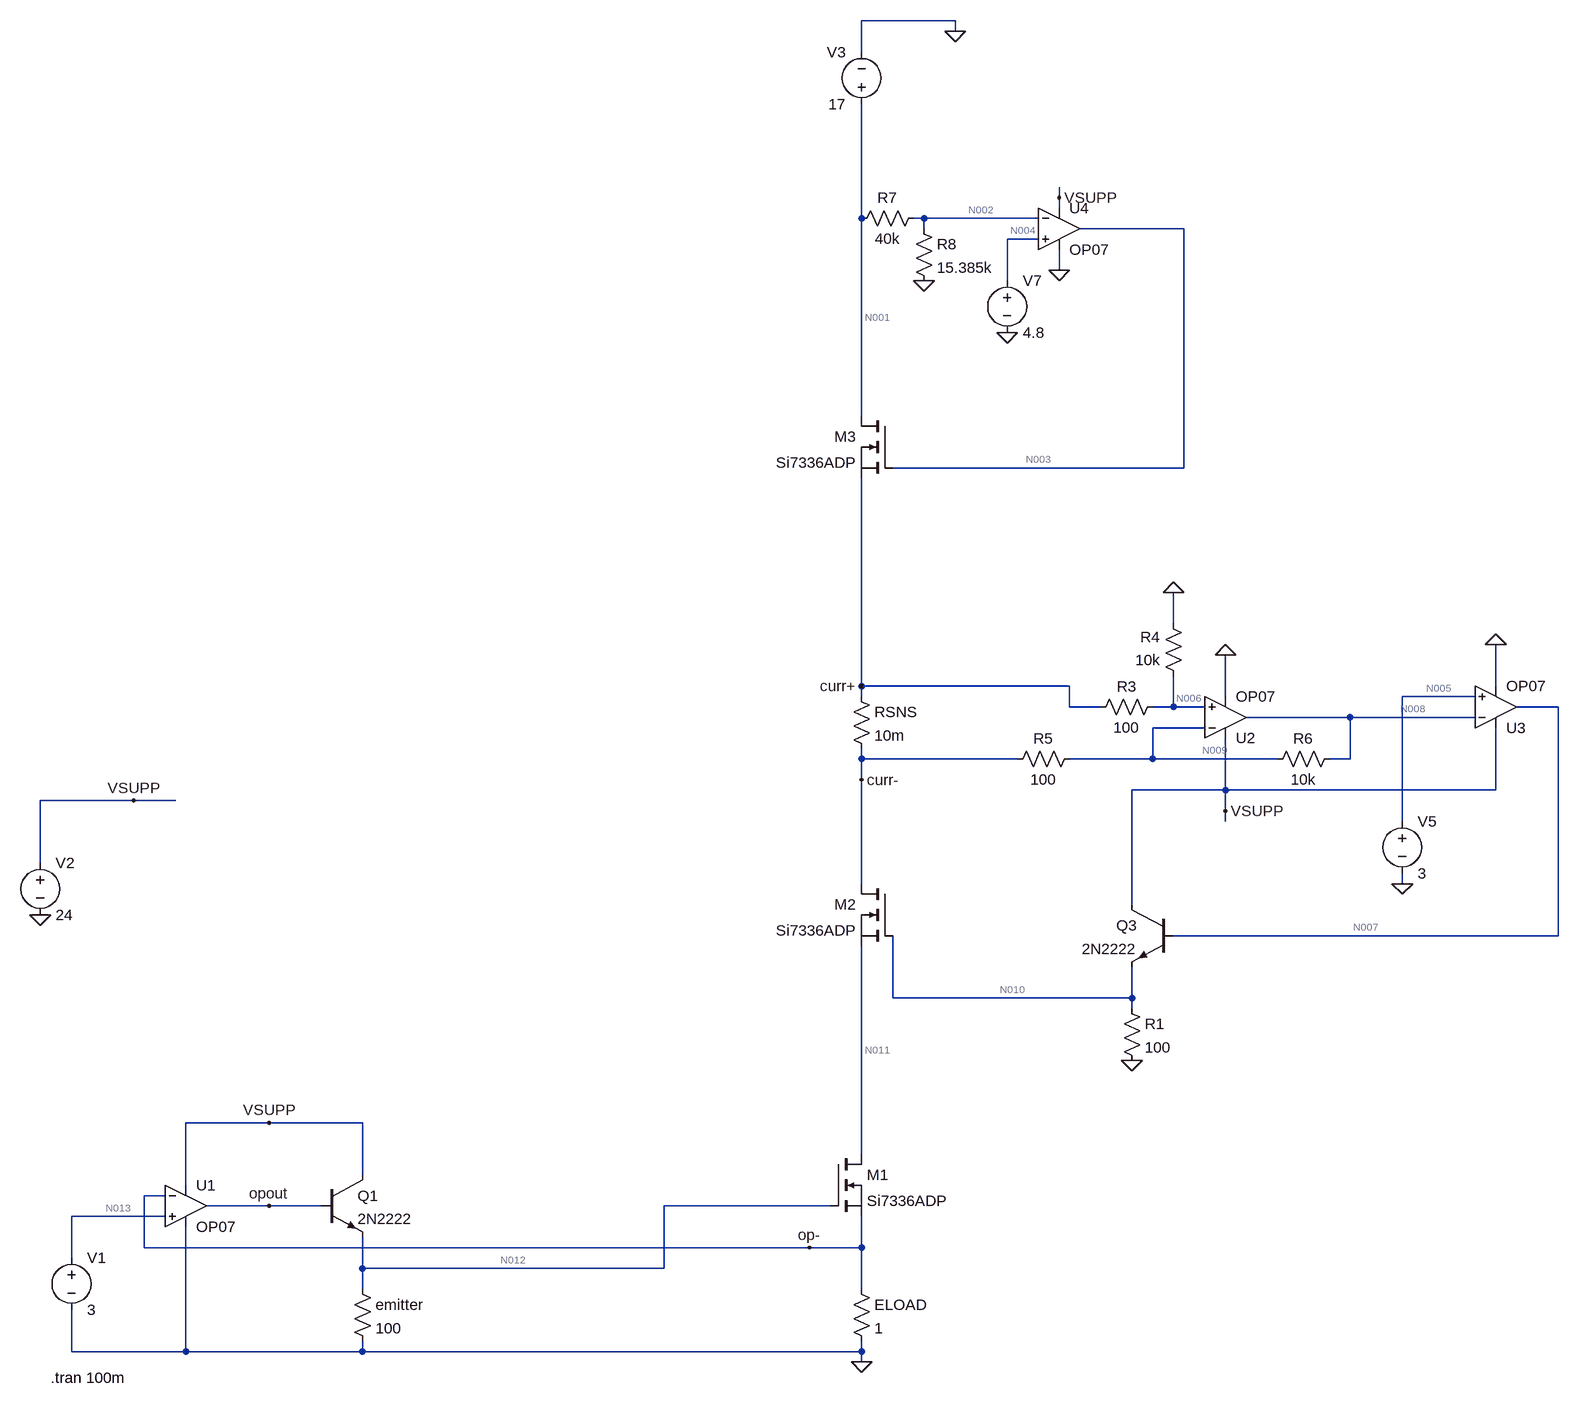
[diagram p0: schematic EloadSimVFollowers.asc]
EloadSimVFollowers.asc, the LTspice schematic file:
Version 4
SHEET 1 1912 680
WIRE 608 -1664 464 -1664
WIRE 608 -1648 608 -1664
WIRE 464 -1616 464 -1664
WIRE 768 -1392 768 -1408
WIRE 768 -1376 768 -1392
WIRE 464 -1360 464 -1536
WIRE 560 -1360 544 -1360
WIRE 736 -1360 560 -1360
WIRE 560 -1344 560 -1360
WIRE 960 -1344 800 -1344
WIRE 736 -1328 688 -1328
WIRE 768 -1280 768 -1312
WIRE 688 -1264 688 -1328
WIRE 464 -1056 464 -1360
WIRE 960 -976 960 -1344
WIRE 960 -976 512 -976
WIRE 944 -736 944 -784
WIRE 464 -640 464 -960
WIRE 784 -640 464 -640
WIRE 1440 -640 1440 -704
WIRE 464 -624 464 -640
WIRE 1024 -624 1024 -688
WIRE 1408 -624 1296 -624
WIRE 784 -608 784 -640
WIRE 832 -608 784 -608
WIRE 944 -608 944 -656
WIRE 944 -608 912 -608
WIRE 992 -608 944 -608
WIRE 1536 -608 1472 -608
WIRE 1216 -592 1056 -592
WIRE 1408 -592 1216 -592
WIRE 992 -576 912 -576
WIRE 464 -528 464 -544
WIRE 704 -528 464 -528
WIRE 912 -528 912 -576
WIRE 912 -528 784 -528
WIRE 1104 -528 912 -528
WIRE 1216 -528 1216 -592
WIRE 1216 -528 1184 -528
WIRE 464 -496 464 -528
WIRE 1024 -480 1024 -560
WIRE 1024 -480 880 -480
WIRE 1440 -480 1440 -576
WIRE 1440 -480 1024 -480
WIRE -656 -464 -800 -464
WIRE -592 -464 -656 -464
WIRE 1024 -448 1024 -480
WIRE 1024 -432 1024 -448
WIRE 1296 -432 1296 -624
WIRE -800 -368 -800 -464
WIRE 464 -336 464 -496
WIRE 1296 -336 1296 -352
WIRE 880 -304 880 -480
WIRE 1536 -256 1536 -608
WIRE 1536 -256 944 -256
WIRE 512 -160 512 -256
WIRE 880 -160 880 -208
WIRE 880 -160 512 -160
WIRE 880 -144 880 -160
WIRE -448 32 -576 32
WIRE -304 32 -448 32
WIRE 464 80 464 -240
WIRE -304 112 -304 32
WIRE -576 128 -576 32
WIRE -608 144 -640 144
WIRE -448 160 -544 160
WIRE -368 160 -448 160
WIRE 416 160 160 160
WIRE -608 176 -752 176
WIRE -640 224 -640 144
WIRE 384 224 -640 224
WIRE 464 224 464 176
WIRE 464 224 384 224
WIRE -752 240 -752 176
WIRE -304 256 -304 208
WIRE 160 256 160 160
WIRE 160 256 -304 256
WIRE -304 288 -304 256
WIRE 464 288 464 224
WIRE -752 384 -752 320
WIRE -576 384 -576 192
WIRE -576 384 -752 384
WIRE -304 384 -304 368
WIRE -304 384 -576 384
WIRE 464 384 464 368
WIRE 464 384 -304 384
WIRE 464 400 464 384
FLAG 464 400 0
FLAG 608 -1648 0
FLAG -448 160 opout
FLAG 384 224 op-
FLAG 464 -640 curr+
FLAG 464 -496 curr-
FLAG 1296 -336 0
FLAG 944 -784 0
FLAG 1024 -688 0
FLAG 1440 -704 0
FLAG 560 -1264 0
FLAG 768 -1280 0
FLAG 688 -1184 0
FLAG 880 -64 0
FLAG -800 -288 0
FLAG -656 -464 VSUPP
FLAG -448 32 VSUPP
FLAG 1024 -448 VSUPP
FLAG 768 -1392 VSUPP
SYMBOL OpAmps\\OP07 -576 96 R0
SYMATTR InstName U1
SYMBOL nmos 416 80 R0
SYMATTR InstName M1
SYMATTR Value Si7336ADP
SYMBOL res 448 272 R0
SYMATTR InstName ELOAD
SYMATTR Value 1
SYMBOL voltage -752 224 R0
WINDOW 123 0 0 Left 0
WINDOW 39 0 0 Left 0
SYMATTR InstName V1
SYMATTR Value 3
SYMBOL voltage 464 -1520 R180
WINDOW 0 24 96 Left 2
WINDOW 3 24 16 Left 2
WINDOW 123 0 0 Left 0
WINDOW 39 0 0 Left 0
SYMATTR InstName V3
SYMATTR Value 17
SYMBOL res 448 -640 R0
SYMATTR InstName RSNS
SYMATTR Value 10m
SYMBOL OpAmps\\OP07 1024 -528 M180
SYMATTR InstName U2
SYMBOL res 928 -624 R90
WINDOW 0 0 56 VBottom 2
WINDOW 3 32 56 VTop 2
SYMATTR InstName R3
SYMATTR Value 100
SYMBOL res 960 -640 R180
WINDOW 0 36 76 Left 2
WINDOW 3 36 40 Left 2
SYMATTR InstName R4
SYMATTR Value 10k
SYMBOL res 800 -544 R90
WINDOW 0 0 56 VBottom 2
WINDOW 3 32 56 VTop 2
SYMATTR InstName R5
SYMATTR Value 100
SYMBOL res 1200 -544 R90
WINDOW 0 0 56 VBottom 2
WINDOW 3 32 56 VTop 2
SYMATTR InstName R6
SYMATTR Value 10k
SYMBOL OpAmps\\OP07 1440 -544 M180
SYMATTR InstName U3
SYMBOL voltage 1296 -448 R0
WINDOW 123 0 0 Left 0
WINDOW 39 0 0 Left 0
SYMATTR InstName V5
SYMATTR Value 3
SYMBOL nmos 512 -336 M0
SYMATTR InstName M2
SYMATTR Value Si7336ADP
SYMBOL res 560 -1376 R90
WINDOW 0 0 56 VBottom 2
WINDOW 3 32 56 VTop 2
SYMATTR InstName R7
SYMATTR Value 40k
SYMBOL res 544 -1360 R0
SYMATTR InstName R8
SYMATTR Value 15.385k
SYMBOL OpAmps\\OP07 768 -1408 R0
SYMATTR InstName U4
SYMBOL nmos 512 -1056 M0
SYMATTR InstName M3
SYMATTR Value Si7336ADP
SYMBOL voltage 688 -1280 R0
WINDOW 123 0 0 Left 0
WINDOW 39 0 0 Left 0
SYMATTR InstName V7
SYMATTR Value 4.8
SYMBOL npn -368 112 R0
SYMATTR InstName Q1
SYMATTR Value 2N2222
SYMBOL res -320 272 R0
SYMATTR InstName emitter
SYMATTR Value 100
SYMBOL res 864 -160 R0
SYMATTR InstName R1
SYMATTR Value 100
SYMBOL npn 944 -304 M0
SYMATTR InstName Q3
SYMATTR Value 2N2222
SYMBOL voltage -800 -384 R0
WINDOW 123 0 0 Left 0
WINDOW 39 0 0 Left 0
SYMATTR InstName V2
SYMATTR Value 24
TEXT -784 424 Left 2 !.tran 100m

The netlist it stands for:
* EloadSimVFollowers.asc
XU1 N013 op- VSUPP 0 opout LT1001  ; OP07, pins In+ In- V+ V- OUT
M1 N011 N012 op- op- Si7336ADP
R§ELOAD op- 0 1
V1 N013 0 3
V3 N001 0 17
RSNS curr+ curr- 10m
XU2 N006 N009 VSUPP 0 N008 LT1001  ; OP07, pins In+ In- V+ V- OUT
R3 N006 curr+ 100
R4 N006 0 10k
R5 N009 curr- 100
R6 N008 N009 10k
XU3 N005 N008 VSUPP 0 N007 LT1001  ; OP07, pins In+ In- V+ V- OUT
V5 N005 0 3
M2 curr- N010 N011 N011 Si7336ADP
R7 N002 N001 40k
R8 N002 0 15.385k
XU4 N004 N002 VSUPP 0 N003 LT1001  ; OP07, pins In+ In- V+ V- OUT
M3 N001 N003 curr+ curr+ Si7336ADP
V7 N004 0 4.8
Q1 VSUPP opout N012 0 2N2222
R§emitter N012 0 100
R1 N010 0 100
Q3 VSUPP N007 N010 0 2N2222
V2 VSUPP 0 24
.model NPN NPN
.model PNP PNP
.lib standard.bjt
.model NMOS NMOS
.model PMOS PMOS
.lib standard.mos
.tran 100m
.lib LTC.lib
.backanno
.end

* Results of the author's LTspice run, read from the files saved beside the schematic
* Operating Point, zero values left out:
*   V(op-) = 2.997 V
*   V(n013) = 3 V
*   V(vsupp) = 24 V
*   V(opout) = 23 V
*   V(n011) = 3.004 V
*   V(n012) = 22.13 V
*   V(n001) = 17 V
*   V(curr+) = 16.99 V
*   V(curr-) = 16.96 V
*   V(n009) = 16.82 V
*   V(n006) = 16.82 V
*   V(n008) = 3 V
*   V(n005) = 3 V
*   V(n007) = 6.79 V
*   V(n010) = 6.014 V
*   V(n002) = 4.722 V
*   V(n004) = 4.8 V
*   V(n003) = 23.07 V
*   Ic(Q3) = 59.84 mA
*   Ib(Q3) = 298.8 µA
*   Ie(Q3) = -60.14 mA
*   Ic(Q1) = 219.4 mA
*   Ib(Q1) = 1.874 mA
*   Ie(Q1) = -221.3 mA
*   Id(M3) = 3 A
*   Is(M3) = -3 A
*   Id(M2) = 2.997 A
*   Is(M2) = -2.997 A
*   Id(M1) = 2.997 A
*   Is(M1) = -2.997 A
*   I(R1) = 60.14 mA
*   I(Emitter) = 221.3 mA
*   I(R8) = 306.9 µA
*   I(R7) = -306.9 µA
*   I(R6) = -1.382 mA
*   I(R5) = -1.382 mA
*   I(R4) = 1.682 mA
*   I(R3) = -1.682 mA
*   I(Rsns) = 2.999 A
*   I(Eload) = 2.997 A
*   I(V2) = -288.8 mA
*   I(V7) = -1.036 nA
*   I(V5) = 16.16 pA
*   I(V3) = -3.001 A
*   I(V1) = -18.92 pA